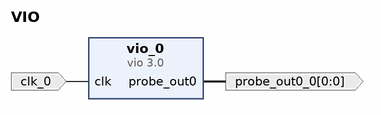
[diagram p0: block diagram of the top level]
# Vivado block design VIO, xc7a35ticsg324-1L, Vivado 2023.1
create_bd_design VIO

create_bd_port -dir I -type clk clk_0
create_bd_port -dir O -from 0 -to 0 probe_out0_0

create_bd_cell -type ip -vlnv xilinx.com:ip:vio:3.0 vio_0
set_property -dict {CONFIG.C_NUM_PROBE_IN 0} [get_bd_cells vio_0]

# ---- connections ----

connect_bd_net -net clk_0_1 [get_bd_ports clk_0] [get_bd_pins vio_0/clk]
connect_bd_net [get_bd_pins vio_0/probe_out0] [get_bd_ports probe_out0_0]

validate_bd_design
save_bd_design
